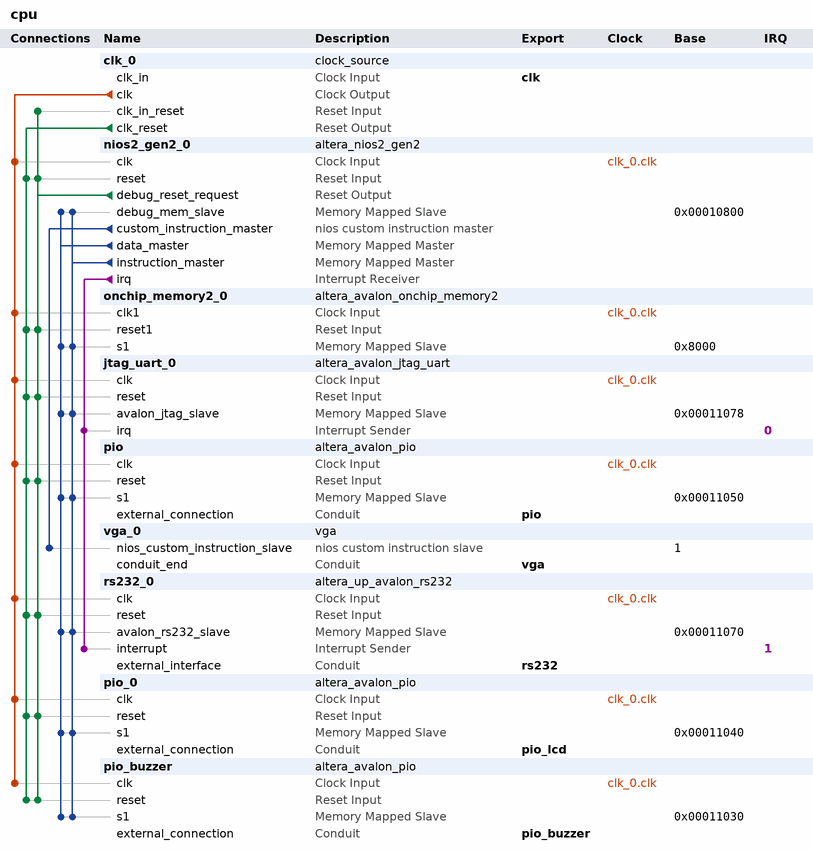
[diagram p0: system contents]
# Platform Designer (Qsys) system cpu, Cyclone IV E EP4CE6E22C8
# Parameters at their usual value, and those the tool derives, are not listed.
package require -exact qsys 18.1
create_system cpu
set_project_property DEVICE_FAMILY {Cyclone IV E}
set_project_property DEVICE EP4CE6E22C8

add_instance clk_0 clock_source 18.1
set_instance_parameter_value clk_0 clockFrequency 50000000

add_instance nios2_gen2_0 altera_nios2_gen2 18.1
set_instance_parameter_value nios2_gen2_0 dcache_size 2048
set_instance_parameter_value nios2_gen2_0 exceptionSlave onchip_memory2_0.s1
set_instance_parameter_value nios2_gen2_0 icache_size 4096
set_instance_parameter_value nios2_gen2_0 impl Tiny
set_instance_parameter_value nios2_gen2_0 resetSlave onchip_memory2_0.s1

add_instance onchip_memory2_0 altera_avalon_onchip_memory2 18.1
set_instance_parameter_value onchip_memory2_0 dataWidth 32
set_instance_parameter_value onchip_memory2_0 dualPort false
set_instance_parameter_value onchip_memory2_0 initMemContent false
set_instance_parameter_value onchip_memory2_0 initializationFileName onchip_mem.hex
set_instance_parameter_value onchip_memory2_0 memorySize 20480

add_instance jtag_uart_0 altera_avalon_jtag_uart 18.1
set_instance_parameter_value jtag_uart_0 simInteractiveOptions NO_INTERACTIVE_WINDOWS

add_instance pio altera_avalon_pio 18.1
set_instance_parameter_value pio direction Input
set_instance_parameter_value pio width 1

add_instance vga_0 vga 1.0
set_instance_parameter_value vga_0 hdat_begin 143
set_instance_parameter_value vga_0 hdat_end 783
set_instance_parameter_value vga_0 hpixel_end 799
set_instance_parameter_value vga_0 hsync_end 95
set_instance_parameter_value vga_0 vdat_begin 34
set_instance_parameter_value vga_0 vdat_end 514
set_instance_parameter_value vga_0 vline_end 524
set_instance_parameter_value vga_0 vsync_end 1

add_instance rs232_0 altera_up_avalon_rs232 17.1
set_instance_parameter_value rs232_0 baud 9600
set_instance_parameter_value rs232_0 parity None

add_instance pio_0 altera_avalon_pio 18.1
set_instance_parameter_value pio_0 direction Output
set_instance_parameter_value pio_0 width 11

add_instance pio_buzzer altera_avalon_pio 18.1
set_instance_parameter_value pio_buzzer direction Output
set_instance_parameter_value pio_buzzer width 1

# connections
add_connection clk_0.clk jtag_uart_0.clk clock
add_connection clk_0.clk nios2_gen2_0.clk clock
add_connection clk_0.clk onchip_memory2_0.clk1 clock
add_connection clk_0.clk pio.clk clock
add_connection clk_0.clk pio_0.clk clock
add_connection clk_0.clk pio_buzzer.clk clock
add_connection clk_0.clk rs232_0.clk clock
add_connection clk_0.clk_reset jtag_uart_0.reset reset
add_connection clk_0.clk_reset nios2_gen2_0.reset reset
add_connection clk_0.clk_reset onchip_memory2_0.reset1 reset
add_connection clk_0.clk_reset pio.reset reset
add_connection clk_0.clk_reset pio_0.reset reset
add_connection clk_0.clk_reset pio_buzzer.reset reset
add_connection clk_0.clk_reset rs232_0.reset reset
add_connection nios2_gen2_0.debug_reset_request clk_0.clk_in_reset reset
add_connection nios2_gen2_0.debug_reset_request jtag_uart_0.reset reset
add_connection nios2_gen2_0.debug_reset_request nios2_gen2_0.reset reset
add_connection nios2_gen2_0.debug_reset_request onchip_memory2_0.reset1 reset
add_connection nios2_gen2_0.debug_reset_request pio.reset reset
add_connection nios2_gen2_0.debug_reset_request pio_0.reset reset
add_connection nios2_gen2_0.debug_reset_request pio_buzzer.reset reset
add_connection nios2_gen2_0.debug_reset_request rs232_0.reset reset
add_connection nios2_gen2_0.data_master jtag_uart_0.avalon_jtag_slave avalon
set_connection_parameter_value nios2_gen2_0.data_master/jtag_uart_0.avalon_jtag_slave baseAddress 0x00011078
add_connection nios2_gen2_0.data_master nios2_gen2_0.debug_mem_slave avalon
set_connection_parameter_value nios2_gen2_0.data_master/nios2_gen2_0.debug_mem_slave baseAddress 0x00010800
add_connection nios2_gen2_0.data_master onchip_memory2_0.s1 avalon
set_connection_parameter_value nios2_gen2_0.data_master/onchip_memory2_0.s1 baseAddress 0x8000
add_connection nios2_gen2_0.data_master pio.s1 avalon
set_connection_parameter_value nios2_gen2_0.data_master/pio.s1 baseAddress 0x00011050
add_connection nios2_gen2_0.data_master pio_0.s1 avalon
set_connection_parameter_value nios2_gen2_0.data_master/pio_0.s1 baseAddress 0x00011040
add_connection nios2_gen2_0.data_master pio_buzzer.s1 avalon
set_connection_parameter_value nios2_gen2_0.data_master/pio_buzzer.s1 baseAddress 0x00011030
add_connection nios2_gen2_0.data_master rs232_0.avalon_rs232_slave avalon
set_connection_parameter_value nios2_gen2_0.data_master/rs232_0.avalon_rs232_slave baseAddress 0x00011070
add_connection nios2_gen2_0.instruction_master jtag_uart_0.avalon_jtag_slave avalon
set_connection_parameter_value nios2_gen2_0.instruction_master/jtag_uart_0.avalon_jtag_slave baseAddress 0x00011078
add_connection nios2_gen2_0.instruction_master nios2_gen2_0.debug_mem_slave avalon
set_connection_parameter_value nios2_gen2_0.instruction_master/nios2_gen2_0.debug_mem_slave baseAddress 0x00010800
add_connection nios2_gen2_0.instruction_master onchip_memory2_0.s1 avalon
set_connection_parameter_value nios2_gen2_0.instruction_master/onchip_memory2_0.s1 baseAddress 0x8000
add_connection nios2_gen2_0.instruction_master pio.s1 avalon
set_connection_parameter_value nios2_gen2_0.instruction_master/pio.s1 baseAddress 0x00011050
add_connection nios2_gen2_0.instruction_master pio_0.s1 avalon
set_connection_parameter_value nios2_gen2_0.instruction_master/pio_0.s1 baseAddress 0x00011040
add_connection nios2_gen2_0.instruction_master pio_buzzer.s1 avalon
set_connection_parameter_value nios2_gen2_0.instruction_master/pio_buzzer.s1 baseAddress 0x00011030
add_connection nios2_gen2_0.instruction_master rs232_0.avalon_rs232_slave avalon
set_connection_parameter_value nios2_gen2_0.instruction_master/rs232_0.avalon_rs232_slave baseAddress 0x00011070
add_connection nios2_gen2_0.irq jtag_uart_0.irq interrupt
set_connection_parameter_value nios2_gen2_0.irq/jtag_uart_0.irq irqNumber 0
add_connection nios2_gen2_0.irq rs232_0.interrupt interrupt
set_connection_parameter_value nios2_gen2_0.irq/rs232_0.interrupt irqNumber 1
add_connection nios2_gen2_0.custom_instruction_master vga_0.nios_custom_instruction_slave nios_custom_instruction
set_connection_parameter_value nios2_gen2_0.custom_instruction_master/vga_0.nios_custom_instruction_slave CIName vga
set_connection_parameter_value nios2_gen2_0.custom_instruction_master/vga_0.nios_custom_instruction_slave baseAddress 1

# exported interfaces
add_interface clk clock sink
set_interface_property clk EXPORT_OF clk_0.clk_in
add_interface pio conduit end
set_interface_property pio EXPORT_OF pio.external_connection
add_interface pio_buzzer conduit end
set_interface_property pio_buzzer EXPORT_OF pio_buzzer.external_connection
add_interface pio_lcd conduit end
set_interface_property pio_lcd EXPORT_OF pio_0.external_connection
add_interface rs232 conduit end
set_interface_property rs232 EXPORT_OF rs232_0.external_interface
add_interface vga conduit end
set_interface_property vga EXPORT_OF vga_0.conduit_end

set_interconnect_requirement {$system} qsys_mm.clockCrossingAdapter HANDSHAKE
set_interconnect_requirement {$system} qsys_mm.enableEccProtection FALSE
set_interconnect_requirement {$system} qsys_mm.insertDefaultSlave FALSE
set_interconnect_requirement {$system} qsys_mm.maxAdditionalLatency 1

save_system cpu.qsys
